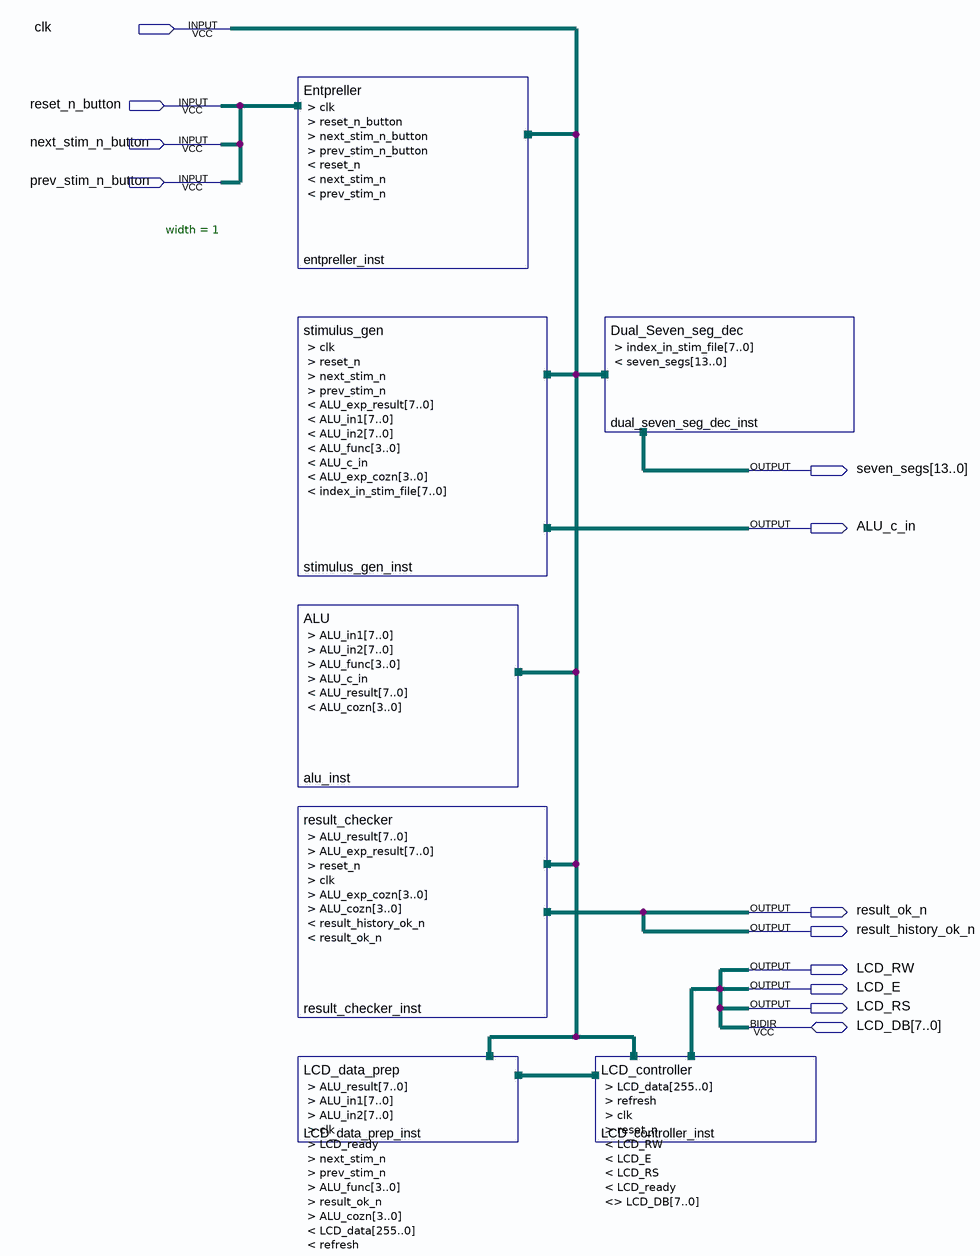
[diagram p0: schematic sheet]
// Quartus schematic CA12_ALU.bdf as structural Verilog: 7 symbols, 12 pins
module CA12_ALU (
  input  clk,
  input  reset_n_button,
  input  next_stim_n_button,
  input  prev_stim_n_button,
  inout  [7:0] LCD_DB,
  output [13:0] seven_segs,
  output ALU_c_in,
  output result_ok_n,
  output result_history_ok_n,
  output LCD_RW,
  output LCD_E,
  output LCD_RS
);

  wire LCD_ready, next_stim_n, prev_stim_n, refresh, reset_n;
  wire [3:0] ALU_cozn, ALU_exp_cozn, ALU_func;
  wire [7:0] ALU_exp_result, ALU_in1, ALU_in2, ALU_result, index_in_stim_file;
  wire [255:0] LCD_data;

  Entpreller #(.width(1)) entpreller_inst (
    .clk(clk), .reset_n_button(reset_n_button), .next_stim_n_button(next_stim_n_button),
    .prev_stim_n_button(prev_stim_n_button), .reset_n(reset_n), .next_stim_n(next_stim_n),
    .prev_stim_n(prev_stim_n));
  stimulus_gen stimulus_gen_inst (
    .clk(clk), .reset_n(reset_n), .next_stim_n(next_stim_n), .prev_stim_n(prev_stim_n),
    .ALU_exp_result(ALU_exp_result), .ALU_in1(ALU_in1), .ALU_in2(ALU_in2), .ALU_func(ALU_func),
    .ALU_c_in(ALU_c_in), .ALU_exp_cozn(ALU_exp_cozn), .index_in_stim_file(index_in_stim_file));
  ALU alu_inst (
    .ALU_in1(ALU_in1), .ALU_in2(ALU_in2), .ALU_func(ALU_func), .ALU_c_in(ALU_c_in), .ALU_result(ALU_result),
    .ALU_cozn(ALU_cozn));
  result_checker result_checker_inst (
    .ALU_result(ALU_result), .ALU_exp_result(ALU_exp_result), .reset_n(reset_n), .clk(clk),
    .ALU_exp_cozn(ALU_exp_cozn), .ALU_cozn(ALU_cozn), .result_history_ok_n(result_history_ok_n),
    .result_ok_n(result_ok_n));
  LCD_data_prep LCD_data_prep_inst (
    .ALU_result(ALU_result), .ALU_in1(ALU_in1), .ALU_in2(ALU_in2), .clk(clk), .LCD_ready(LCD_ready),
    .next_stim_n(next_stim_n), .prev_stim_n(prev_stim_n), .ALU_func(ALU_func), .result_ok_n(result_ok_n),
    .ALU_cozn(ALU_cozn), .LCD_data(LCD_data), .refresh(refresh));
  Dual_Seven_seg_dec dual_seven_seg_dec_inst (.index_in_stim_file(index_in_stim_file), .seven_segs(seven_segs));
  LCD_controller LCD_controller_inst (
    .LCD_data(LCD_data), .refresh(refresh), .clk(clk), .reset_n(reset_n), .LCD_RW(LCD_RW), .LCD_E(LCD_E),
    .LCD_RS(LCD_RS), .LCD_ready(LCD_ready), .LCD_DB(LCD_DB));
endmodule
